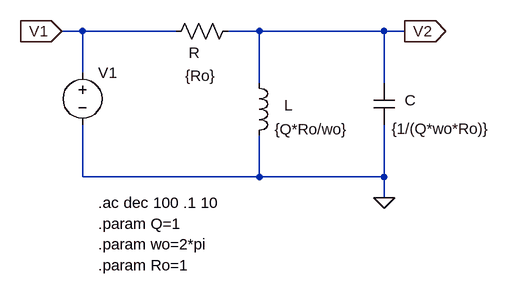
[diagram p0: schematic SOS_pasabanda_simple.asc]
SOS_pasabanda_simple.asc, the LTspice schematic file:
Version 4
SHEET 1 880 680
WIRE -224 112 -256 112
WIRE -80 112 -224 112
WIRE 48 112 0 112
WIRE 240 112 48 112
WIRE 272 112 240 112
WIRE -224 176 -224 112
WIRE 48 192 48 112
WIRE 240 192 240 112
WIRE -224 336 -224 256
WIRE 48 336 48 272
WIRE 48 336 -224 336
WIRE 240 336 240 256
WIRE 240 336 48 336
WIRE 240 368 240 336
FLAG -256 112 V1
IOPIN -256 112 In
FLAG 272 112 V2
IOPIN 272 112 Out
FLAG 240 368 0
SYMBOL ind 32 176 R0
WINDOW 0 54 50 Left 2
WINDOW 3 40 87 Left 2
SYMATTR InstName L
SYMATTR Value {Q*Ro/wo}
SYMBOL cap 224 192 R0
WINDOW 3 28 70 Left 2
WINDOW 0 48 26 Left 2
SYMATTR Value {1/(Q*wo*Ro)}
SYMATTR InstName C
SYMBOL voltage -224 160 R0
WINDOW 3 24 96 Invisible 2
WINDOW 39 0 0 Left 0
SYMATTR Value SINE(0 1 0 0 0 0 1000)
SYMATTR InstName V1
SYMATTR Value2 AC 1 0
SYMBOL res 16 96 R90
WINDOW 0 65 68 VBottom 2
WINDOW 3 69 58 VTop 2
SYMATTR InstName R
SYMATTR Value {Ro}
TEXT -200 376 Left 2 !.ac dec 100 .1 10
TEXT -200 408 Left 2 !.param Q=1
TEXT -200 440 Left 2 !.param wo=2*pi
TEXT -200 472 Left 2 !.param Ro=1

The netlist it stands for:
* SOS_pasabanda_simple.asc
L V2 0 {Q*Ro/wo}
C V2 0 {1/(Q*wo*Ro)}
V1 V1 0 SINE(0 1 0 0 0 0 1000) AC 1 0
R V2 V1 {Ro}
.ac dec 100 .1 10
.param Q=1
.param wo=2*pi
.param Ro=1
.backanno
.end